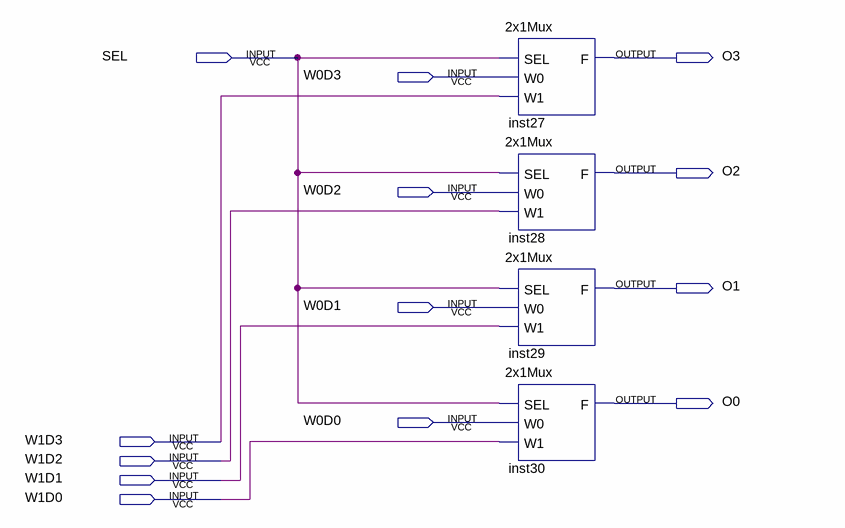
[diagram p0: schematic sheet]
// Quartus schematic 4InputSelector.bdf as structural Verilog: 4 symbols, 13 pins
module \4InputSelector  (
  input  SEL,
  input  W0D3,
  input  W0D2,
  input  W0D1,
  input  W0D0,
  input  W1D3,
  input  W1D2,
  input  W1D1,
  input  W1D0,
  output O3,
  output O2,
  output O1,
  output O0
);

  \2x1Mux  inst27 (.SEL(SEL), .W0(W0D3), .W1(W1D3), .F(O3));
  \2x1Mux  inst28 (.SEL(SEL), .W0(W0D2), .W1(W1D2), .F(O2));
  \2x1Mux  inst29 (.SEL(SEL), .W0(W0D1), .W1(W1D1), .F(O1));
  \2x1Mux  inst30 (.SEL(SEL), .W0(W0D0), .W1(W1D0), .F(O0));
endmodule
